# Altium schematic sheet SyncBoard1.SchDoc
size A2; SheetNumber: 1; SheetTotal: 1
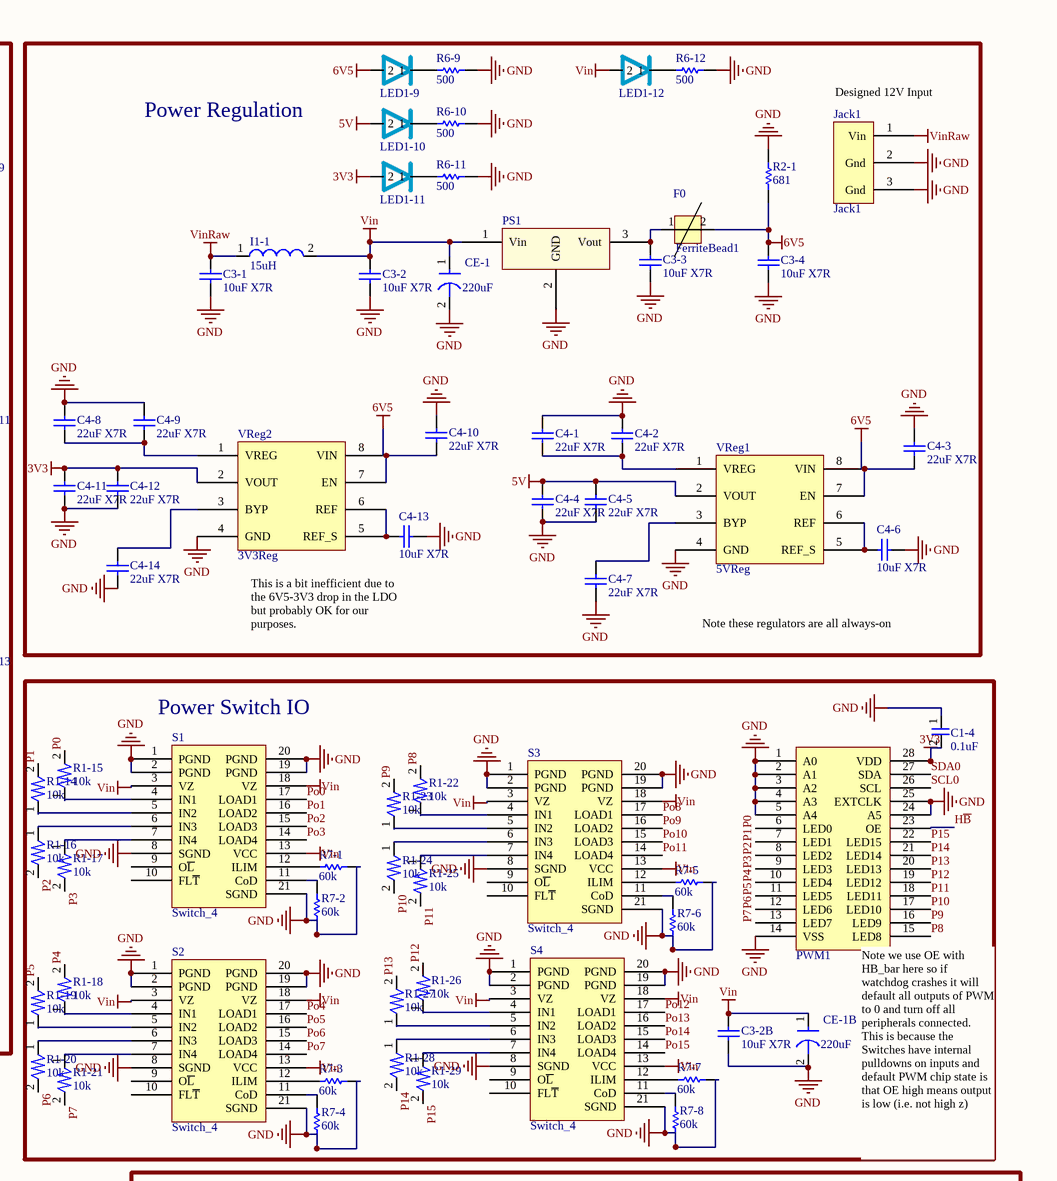
[diagram p0: SyncBoard1.SchDoc, top right]
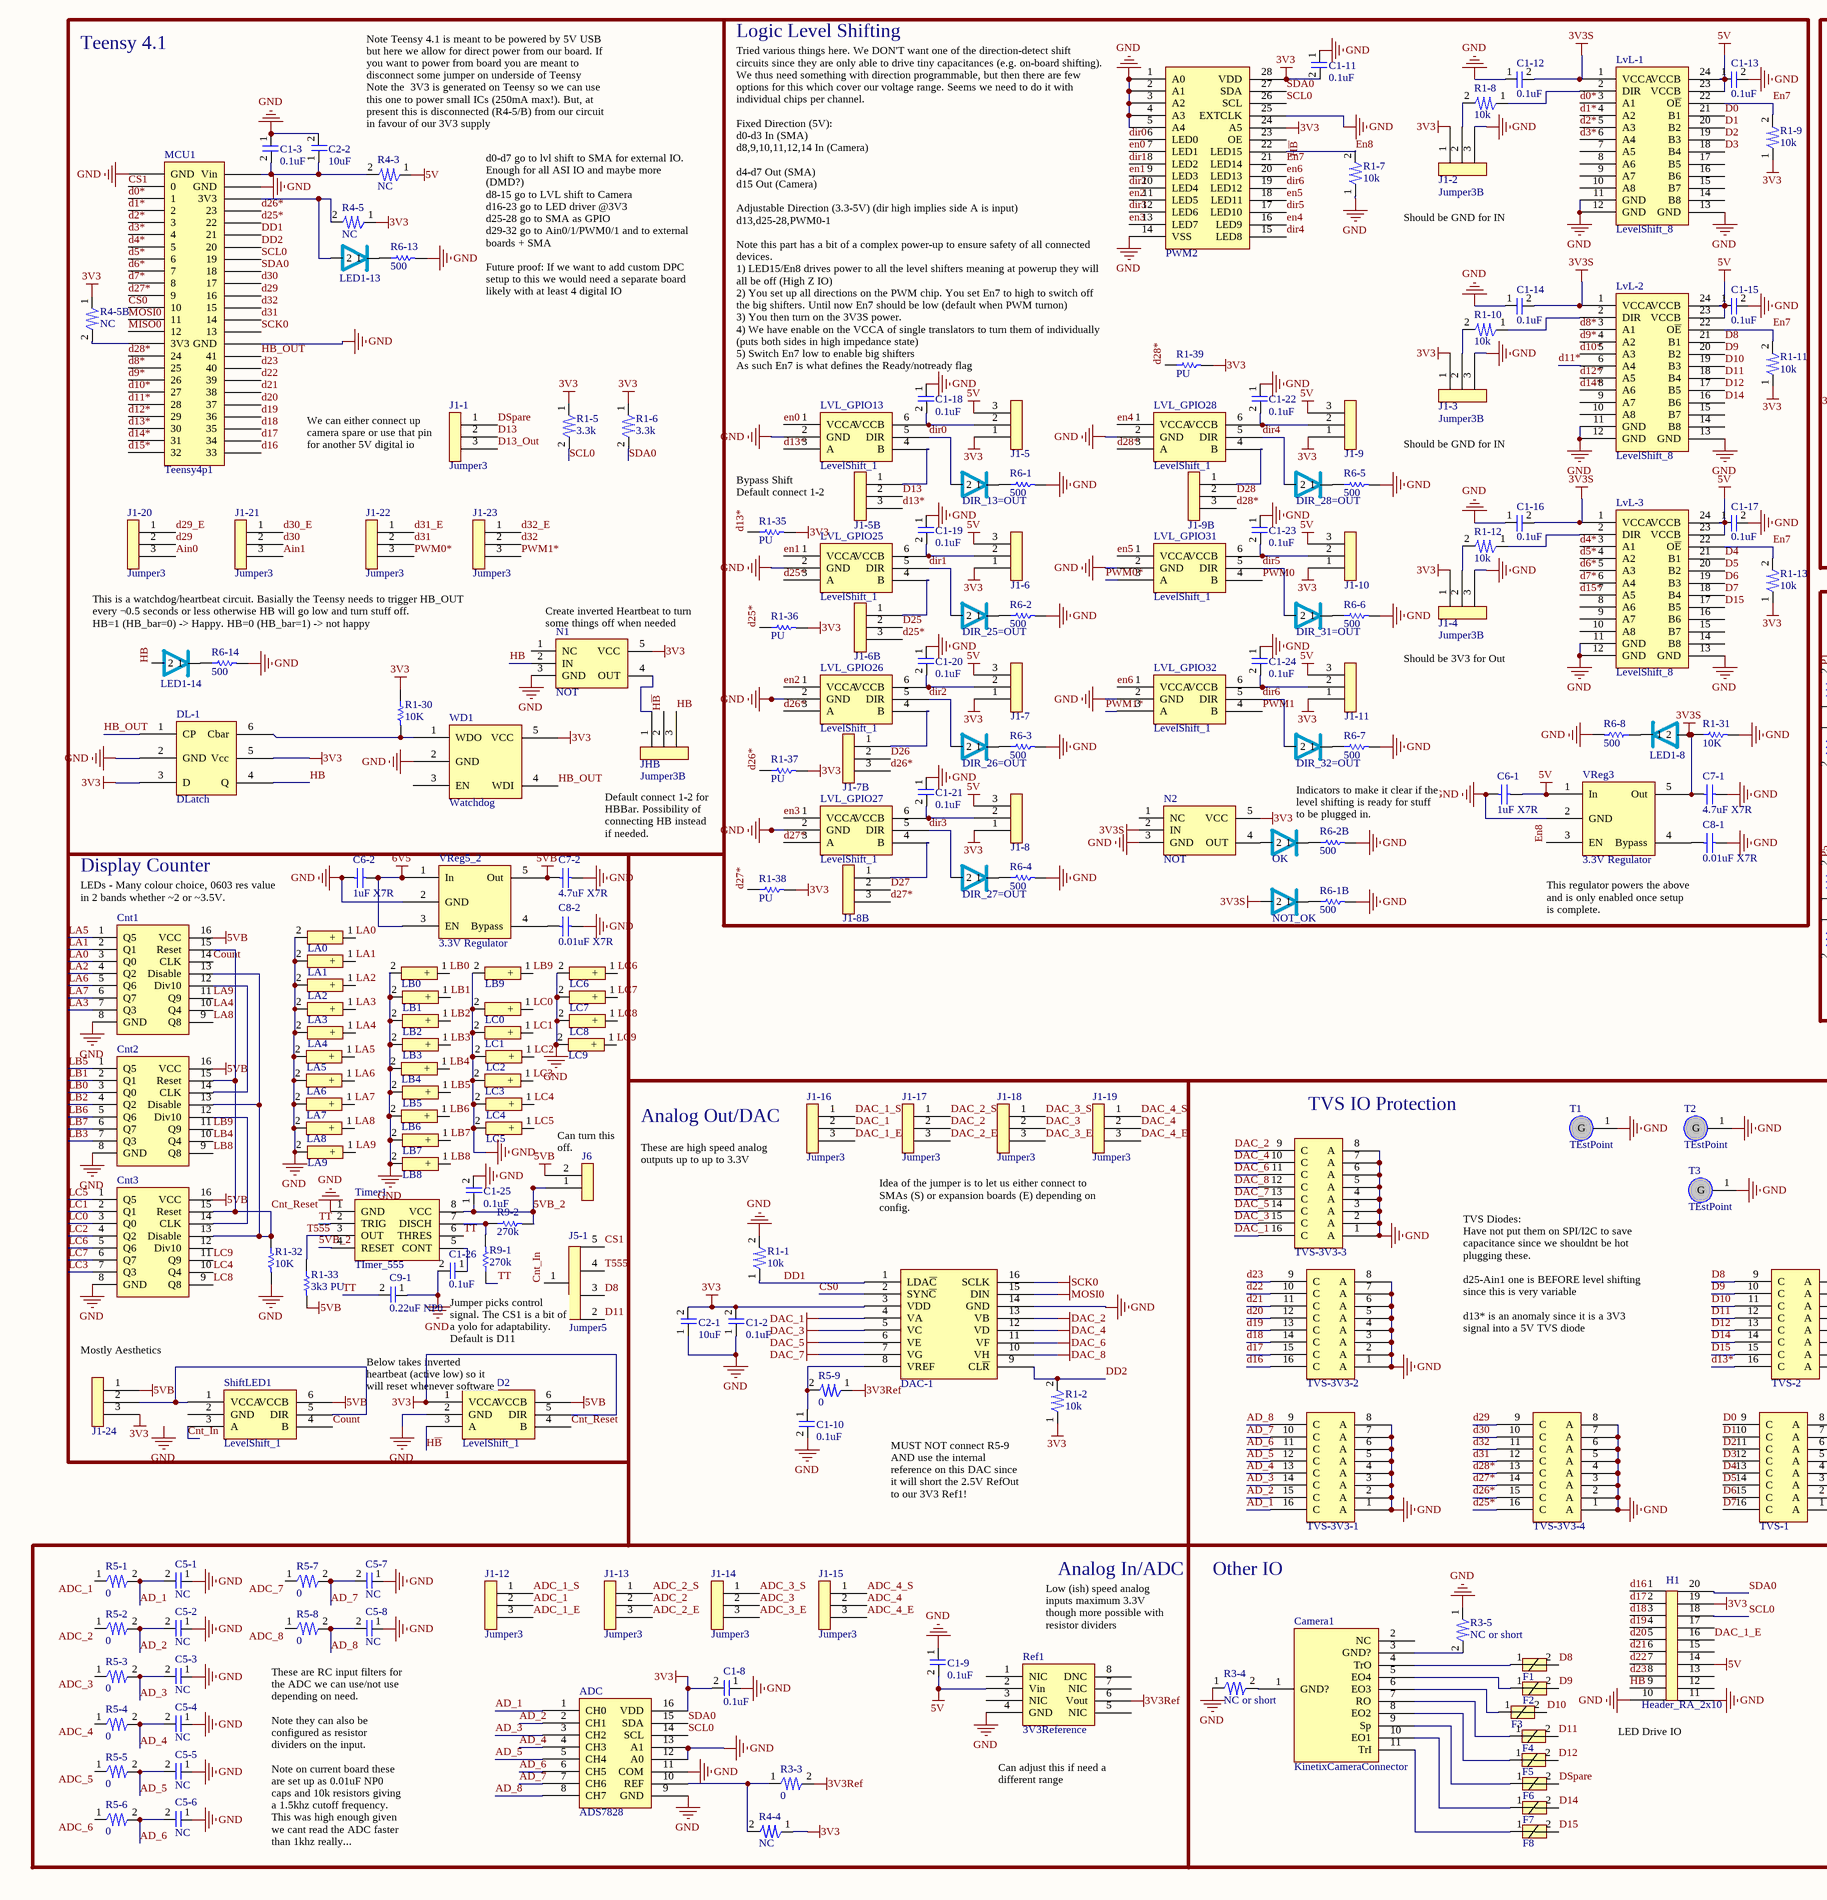
[diagram p1: SyncBoard1.SchDoc, bottom left]
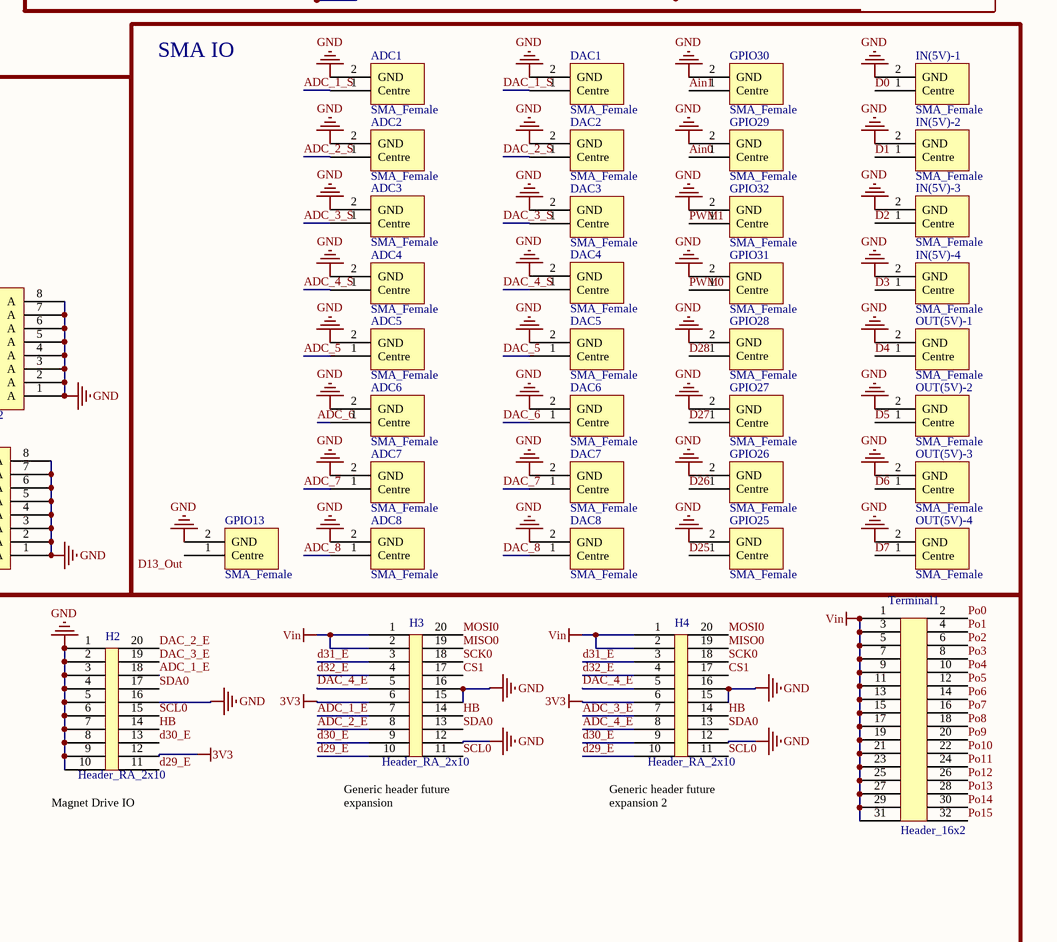
[diagram p2: SyncBoard1.SchDoc, bottom right]

## Parts
ADC  ADS7828  [16-TSSOP]
ADC1  SMA_Female  [SMA_Ferrite]
ADC2  SMA_Female  [SMA_Ferrite]
ADC3  SMA_Female  [SMA_Ferrite]
ADC4  SMA_Female  [SMA_Ferrite]
ADC5  SMA_Female  [SMA_Ferrite]
ADC6  SMA_Female  [SMA_Ferrite]
ADC7  SMA_Female  [SMA_Ferrite]
ADC8  SMA_Female  [SMA_Ferrite]
C1-2  0.1uF  [0805]
C1-3  0.1uF  [0805]
C1-4  0.1uF  [0805]
C1-8  0.1uF  [0805]
C1-9  0.1uF  [0805]
C1-10  0.1uF  [0805]
C1-11  0.1uF  [0805]
C1-12  0.1uF  [0805]
C1-13  0.1uF  [0805]
C1-14  0.1uF  [0805]
C1-15  0.1uF  [0805]
C1-16  0.1uF  [0805]
C1-17  0.1uF  [0805]
C1-18  0.1uF  [0805]
C1-19  0.1uF  [0805]
C1-20  0.1uF  [0805]
C1-21  0.1uF  [0805]
C1-22  0.1uF  [0805]
C1-23  0.1uF  [0805]
C1-24  0.1uF  [0805]
C1-25  0.1uF  [0805]
C1-26  0.1uF  [0805]
C2-1  10uF  [1206]
C2-2  10uF  [1206]
C3-1  10uF X7R  [1206]
C3-2  10uF X7R  [1206]
C3-2B  10uF X7R  [1206]
C3-3  10uF X7R  [1206]
C3-4  10uF X7R  [1206]
C4-1  22uF X7R  [1206]
C4-2  22uF X7R  [1206]
C4-3  22uF X7R  [1206]
C4-4  22uF X7R  [1206]
C4-5  22uF X7R  [1206]
C4-6  10uF X7R  [1206]
C4-7  22uF X7R  [1206]
C4-8  22uF X7R  [1206]
C4-9  22uF X7R  [1206]
C4-10  22uF X7R  [1206]
C4-11  22uF X7R  [1206]
C4-12  22uF X7R  [1206]
C4-13  10uF X7R  [1206]
C4-14  22uF X7R  [1206]
C5-1  NC  [0805]
C5-2  NC  [0805]
C5-3  NC  [0805]
C5-4  NC  [0805]
C5-5  NC  [0805]
C5-6  NC  [0805]
C5-7  NC  [0805]
C5-8  NC  [0805]
C6-1  1uF X7R  [0805]
C6-2  1uF X7R  [0805]
C7-1  4.7uF X7R  [0805]
C7-2  4.7uF X7R  [0805]
C8-1  0.01uF X7R  [0603]
C8-2  0.01uF X7R  [0603]
C9-1  0.22uF NP0  [1206]
Camera1  KinetixCameraConnector  [Connector_HR212]
CE-1  220uF  [ElectrolyticCapacitor]
CE-1B  220uF  [ElectrolyticCapacitor]
Cnt1  Counter_$017  [16-TSSOP]  (value not drawn)
Cnt2  Counter_$017  [16-TSSOP]  (value not drawn)
Cnt3  Counter_$017  [16-TSSOP]  (value not drawn)
DAC1  SMA_Female  [SMA_Ferrite]
DAC2  SMA_Female  [SMA_Ferrite]
DAC3  SMA_Female  [SMA_Ferrite]
DAC4  SMA_Female  [SMA_Ferrite]
DAC5  SMA_Female  [SMA_Ferrite]
DAC6  SMA_Female  [SMA_Ferrite]
DAC7  SMA_Female  [SMA_Ferrite]
DAC8  SMA_Female  [SMA_Ferrite]
DAC-1  AD5668-2  [16-TSSOP]  (value not drawn)
DIR_13=OUT  LEDindicator  [LEDindicator]  (value not drawn)
DIR_25=OUT  LEDindicator  [LEDindicator]  (value not drawn)
DIR_26=OUT  LEDindicator  [LEDindicator]  (value not drawn)
DIR_27=OUT  LEDindicator  [LEDindicator]  (value not drawn)
DIR_28=OUT  LEDindicator  [LEDindicator]  (value not drawn)
DIR_31=OUT  LEDindicator  [LEDindicator]  (value not drawn)
DIR_32=OUT  LEDindicator  [LEDindicator]  (value not drawn)
DL-1  DLatch  [6-TSSOP / SC-70-6]
F0  FerriteBead1  [FerriteBead1]
F1  FerriteBead2  [0603]  (value not drawn)
F2  FerriteBead2  [0603]  (value not drawn)
F3  FerriteBead2  [0603]  (value not drawn)
F4  FerriteBead2  [0603]  (value not drawn)
F5  FerriteBead2  [0603]  (value not drawn)
F6  FerriteBead2  [0603]  (value not drawn)
F7  FerriteBead2  [0603]  (value not drawn)
F8  FerriteBead2  [0603]  (value not drawn)
GPIO13  SMA_Female  [SMA_Ferrite]
GPIO25  SMA_Female  [SMA_Ferrite]
GPIO26  SMA_Female  [SMA_Ferrite]
GPIO27  SMA_Female  [SMA_Ferrite]
GPIO28  SMA_Female  [SMA_Ferrite]
GPIO29  SMA_Female  [SMA_Ferrite]
GPIO30  SMA_Female  [SMA_Ferrite]
GPIO31  SMA_Female  [SMA_Ferrite]
GPIO32  SMA_Female  [SMA_Ferrite]
H1  Header_RA_2x10  [HeaderRA 2x10]
H2  Header_RA_2x10  [HeaderRA 2x10]
H3  Header_RA_2x10  [HeaderRA 2x10]
H4  Header_RA_2x10  [HeaderRA 2x10]
I1-1  15uH  [Inductor1]
IN(5V)-1  SMA_Female  [SMA_Ferrite]
IN(5V)-2  SMA_Female  [SMA_Ferrite]
IN(5V)-3  SMA_Female  [SMA_Ferrite]
IN(5V)-4  SMA_Female  [SMA_Ferrite]
J1-1  Jumper3  [Jumper3B]
J1-2  Jumper3B  [Jumper3B]
J1-3  Jumper3B  [Jumper3B]
J1-4  Jumper3B  [Jumper3B]
J1-5  Jumper3B  [Jumper3B]  (value not drawn)
J1-5B  Jumper3B  [Jumper3B]  (value not drawn)
J1-6  Jumper3B  [Jumper3B]  (value not drawn)
J1-6B  Jumper3B  [Jumper3B]  (value not drawn)
J1-7  Jumper3B  [Jumper3B]  (value not drawn)
J1-7B  Jumper3B  [Jumper3B]  (value not drawn)
J1-8  Jumper3B  [Jumper3B]  (value not drawn)
J1-8B  Jumper3B  [Jumper3B]  (value not drawn)
J1-9  Jumper3B  [Jumper3B]  (value not drawn)
J1-9B  Jumper3B  [Jumper3B]  (value not drawn)
J1-10  Jumper3B  [Jumper3B]  (value not drawn)
J1-11  Jumper3B  [Jumper3B]  (value not drawn)
J1-12  Jumper3  [Jumper]
J1-13  Jumper3  [Jumper]
J1-14  Jumper3  [Jumper]
J1-15  Jumper3  [Jumper]
J1-16  Jumper3  [Jumper]
J1-17  Jumper3  [Jumper]
J1-18  Jumper3  [Jumper]
J1-19  Jumper3  [Jumper]
J1-20  Jumper3  [Jumper]
J1-21  Jumper3  [Jumper]
J1-22  Jumper3  [Jumper]
J1-23  Jumper3  [Jumper]
J1-24  Jumper3B  [Jumper3B]  (value not drawn)
J5-1  Jumper5  [Jumper5]
J6  Jumper2_Pins  [Jumper2_Pins]  (value not drawn)
Jack1  Jack1  [PowerJack]
JHB  Jumper3B  [Jumper3B]
LA0  LEDSINGLESIDE  [LedSingleSide]  (value not drawn)
LA1  LEDSINGLESIDE  [LedSingleSide]  (value not drawn)
LA2  LEDSINGLESIDE  [LedSingleSide]  (value not drawn)
LA3  LEDSINGLESIDE  [LedSingleSide]  (value not drawn)
LA4  LEDSINGLESIDE  [LedSingleSide]  (value not drawn)
LA5  LEDSINGLESIDE  [LedSingleSide]  (value not drawn)
LA6  LEDSINGLESIDE  [LedSingleSide]  (value not drawn)
LA7  LEDSINGLESIDE  [LedSingleSide]  (value not drawn)
LA8  LEDSINGLESIDE  [LedSingleSide]  (value not drawn)
LA9  LEDSINGLESIDE  [LedSingleSide]  (value not drawn)
LB0  LEDSINGLESIDE  [LedSingleSide]  (value not drawn)
LB1  LEDSINGLESIDE  [LedSingleSide]  (value not drawn)
LB2  LEDSINGLESIDE  [LedSingleSide]  (value not drawn)
LB3  LEDSINGLESIDE  [LedSingleSide]  (value not drawn)
LB4  LEDSINGLESIDE  [LedSingleSide]  (value not drawn)
LB5  LEDSINGLESIDE  [LedSingleSide]  (value not drawn)
LB6  LEDSINGLESIDE  [LedSingleSide]  (value not drawn)
LB7  LEDSINGLESIDE  [LedSingleSide]  (value not drawn)
LB8  LEDSINGLESIDE  [LedSingleSide]  (value not drawn)
LB9  LEDSINGLESIDE  [LedSingleSide]  (value not drawn)
LC0  LEDSINGLESIDE  [LedSingleSide]  (value not drawn)
LC1  LEDSINGLESIDE  [LedSingleSide]  (value not drawn)
LC2  LEDSINGLESIDE  [LedSingleSide]  (value not drawn)
LC3  LEDSINGLESIDE  [LedSingleSide]  (value not drawn)
LC4  LEDSINGLESIDE  [LedSingleSide]  (value not drawn)
LC5  LEDSINGLESIDE  [LedSingleSide]  (value not drawn)
LC6  LEDSINGLESIDE  [LedSingleSide]  (value not drawn)
LC7  LEDSINGLESIDE  [LedSingleSide]  (value not drawn)
LC8  LEDSINGLESIDE  [LedSingleSide]  (value not drawn)
LC9  LEDSINGLESIDE  [LedSingleSide]  (value not drawn)
LED1-8  LEDindicator  [LEDindicator]  (value not drawn)
LED1-9  LEDindicator  [LEDindicator]  (value not drawn)
LED1-10  LEDindicator  [LEDindicator]  (value not drawn)
LED1-11  LEDindicator  [LEDIndicator]  (value not drawn)
LED1-12  LEDindicator  [LEDindicator]  (value not drawn)
LED1-13  LEDindicator  [LEDindicator]  (value not drawn)
LED1-14  LEDindicator  [LEDindicator]  (value not drawn)
LvL-1  LevelShift_8  [24-TSSOP]
LvL-2  LevelShift_8  [24-TSSOP]
LvL-3  LevelShift_8  [24-TSSOP]
LVL_GPIO13  LevelShift_1  [6-TSSOP / SC-70-6]
LVL_GPIO25  LevelShift_1  [6-TSSOP / SC-70-6]
LVL_GPIO26  LevelShift_1  [6-TSSOP / SC-70-6]
LVL_GPIO27  LevelShift_1  [6-TSSOP / SC-70-6]
LVL_GPIO28  LevelShift_1  [6-TSSOP / SC-70-6]
LVL_GPIO31  LevelShift_1  [6-TSSOP / SC-70-6]
LVL_GPIO32  LevelShift_1  [6-TSSOP / SC-70-6]
MCU1  Teensy4p1  [Teensy4p1]
N1  NOT  [SOT23-5]
N2  NOT  [SOT23-5]
NOT_OK  LEDindicator  [LEDindicator]  (value not drawn)
OK  LEDindicator  [LEDindicator]  (value not drawn)
OUT(5V)-1  SMA_Female  [SMA_Ferrite]
OUT(5V)-2  SMA_Female  [SMA_Ferrite]
OUT(5V)-3  SMA_Female  [SMA_Ferrite]
OUT(5V)-4  SMA_Female  [SMA_Ferrite]
PS1  PS1  [PowerSupplySwitch]  (value not drawn)
PWM1  PWM28  [28-TSSOP]  (value not drawn)
PWM2  PWM28  [28-TSSOP]  (value not drawn)
R1-1  10k  [0805]
R1-2  10k  [0805]
R1-5  3.3k  [0805]
R1-6  3.3k  [0805]
R1-7  10k  [0805]
R1-8  10k  [0805]
R1-9  10k  [0805]
R1-10  10k  [0805]
R1-11  10k  [0805]
R1-12  10k  [0805]
R1-13  10k  [0805]
R1-14  10k  [0805]
R1-15  10k  [0805]
R1-16  10k  [0805]
R1-17  10k  [0805]
R1-18  10k  [0805]
R1-19  10k  [0805]
R1-20  10k  [0805]
R1-21  10k  [0805]
R1-22  10k  [0805]
R1-23  10k  [0805]
R1-24  10k  [0805]
R1-25  10k  [0805]
R1-26  10k  [0805]
R1-27  10k  [0805]
R1-28  10k  [0805]
R1-29  10k  [0805]
R1-30  10K  [0805]
R1-31  10K  [0805]
R1-32  10K  [0805]
R1-33  3k3 PU  [0805]
R1-35  PU  [0603]
R1-36  PU  [0603]
R1-37  PU  [0603]
R1-38  PU  [0603]
R1-39  PU  [0603]
R2-1  681  [1206]
R3-3  0  [0805]
R3-4  NC or short  [0805]
R3-5  NC or short  [0805]
R4-3  NC  [0805]
R4-4  NC  [0805]
R4-5  NC  [0805]
R4-5B  NC  [0805]
R5-1  0  [0805]
R5-2  0  [0805]
R5-3  0  [0805]
R5-4  0  [0805]
R5-5  0  [0805]
R5-6  0  [0805]
R5-7  0  [0805]
R5-8  0  [0805]
R5-9  0  [0805]
R6-1  500  [0603]
R6-1B  500  [0603]
R6-2  500  [0603]
R6-2B  500  [0603]
R6-3  500  [0603]
R6-4  500  [0603]
R6-5  500  [0603]
R6-6  500  [0603]
R6-7  500  [0603]
R6-8  500  [0603]
R6-9  500  [0603]
R6-10  500  [0603]
R6-11  500  [0603]
R6-12  500  [0603]
R6-13  500  [0603]
R6-14  500  [0603]
R7-1  60k  [0603]
R7-2  60k  [0603]
R7-3  60k  [0603]
R7-4  60k  [0603]
R7-5  60k  [0603]
R7-6  60k  [0603]
R7-7  60k  [0603]
R7-8  60k  [0603]
R9-1  270k  [0603]
R9-2  270k  [0603]
Ref1  3V3Reference  [8-SOIC-NoHeatPad]
S1  Switch_4  [20-HTSSOP]
S2  Switch_4  [20-HTSSOP]
S3  Switch_4  [20-HTSSOP]
S4  Switch_4  [20-HTSSOP]
ShiftLED1  LevelShift_1  [6-TSSOP / SC-70-6]
ShiftLED2  LevelShift_1  [6-TSSOP / SC-70-6]
T1  TEstPoint  [TestPoint]
T2  TEstPoint  [TestPoint]
T3  TEstPoint  [TestPoint]
Terminal1  Header_16x2  [Header 2x16]
Timer1  TImer_555  [8-SOIC-NoHeatPad]
TVS-1  TVS Diode Array  [16-SOIC]  (value not drawn)
TVS-2  TVS Diode Array  [16-SOIC]  (value not drawn)
TVS-3V3-1  TVS Diode Array  [16-SOIC]  (value not drawn)
TVS-3V3-2  TVS Diode Array  [16-SOIC]  (value not drawn)
TVS-3V3-3  TVS Diode Array  [16-SOIC]  (value not drawn)
TVS-3V3-4  TVS Diode Array  [16-SOIC]  (value not drawn)
VReg1  5VReg  [8-SOIC]
VReg2  3V3Reg  [8-SOIC]
VReg3  3.3V Regulator  [SOT23-5]
VReg5_2  3.3V Regulator  [SOT23-5]
WD1  Watchdog  [SOT23-5]

## Blocks framed on the sheet
Teensy 4.1: C1-3 C2-2 DL-1 J1-1 J1-20-J1-23 JHB LED1-13 LED1-14 MCU1 N1 R1-5 R1-6 R1-30 R4-3 R4-5 R4-5B R6-13 R6-14 WD1
Logic Level Shifting: C1-11-C1-24 C6-1 C7-1 C8-1 DIR_13=OUT DIR_25=OUT DIR_26=OUT DIR_27=OUT DIR_28=OUT DIR_31=OUT DIR_32=OUT J1-2-J1-5 J1-5B J1-6 J1-6B J1-7 J1-7B J1-8 J1-8B J1-9 J1-9B J1-10 J1-11 LED1-8 LvL-1-LvL-3 LVL_GPIO13 LVL_GPIO25-LVL_GPIO28 LVL_GPIO31 LVL_GPIO32 N2 NOT_OK OK PWM2 R1-7-R1-13 R1-31 R1-35-R1-39 R6-1 R6-1B R6-2 R6-2B R6-3-R6-8 VReg3
Power Regulation: C3-1-C3-4 C4-1-C4-14 CE-1 F0 I1-1 Jack1 LED1-9-LED1-12 PS1 R2-1 R6-9-R6-12 VReg1 VReg2
Power Switch IO: C1-4 C3-2B CE-1B PWM1 R1-14-R1-29 R7-1-R7-8 S1-S4
Display Counter: C1-25 C1-26 C6-2 C7-2 C8-2 C9-1 Cnt1-Cnt3 J1-24 J5-1 J6 LA0-LA9 LB0-LB9 LC0-LC9 R1-32 R1-33 R9-1 R9-2 ShiftLED1 ShiftLED2 Timer1 VReg5_2
SMA IO: ADC1-ADC8 DAC1-DAC8 GPIO13 GPIO25-GPIO32 IN(5V)-1-IN(5V)-4 OUT(5V)-1-OUT(5V)-4
Analog Out/DAC: C1-2 C1-10 C2-1 DAC-1 J1-16-J1-19 R1-1 R1-2 R5-9
TVS IO Protection: T1-T3 TVS-1 TVS-2 TVS-3V3-1-TVS-3V3-4
Analog In/ADC: ADC C1-8 C1-9 C5-1-C5-8 J1-12-J1-15 R3-3 R4-4 R5-1-R5-8 Ref1
Other IO: Camera1 F1-F8 H1-H4 R3-4 R3-5 Terminal1

## Nets
3V3: ADC.16(VDD) C1-2.2 C1-4.2 C1-8.2 C1-11.2 C2-1.2 C4-11.2 C4-12.2 DAC-1.3(VDD) DL-1.3(D) DL-1.5(Vcc) H1.19 H2.12 H3.6 H4.6 J1-2.1 J1-3.1 J1-4.1 J1-5.1 J1-6.1 J1-7.1 J1-8.1 J1-9.1 J1-10.1 J1-11.1 J1-24.3 LED1-11.2 N1.5(VCC) N2.5(VCC) PWM1.28(VDD) PWM2.24(A5) PWM2.28(VDD) R1-2.1 R1-5.1 R1-6.1 R1-9.1 R1-11.1 R1-13.1 R1-30.1 R1-35.2 R1-36.2 R1-37.2 R1-38.2 R1-39.2 R4-4.1 R4-5.1 R4-5B.1 ShiftLED2.1(VCCA) ShiftLED2.5(DIR) VReg2.2(VOUT) WD1.5(VCC)
3V3Ref: R3-3.2 R5-9.1 Ref1.6(Vout)
3V3S: C1-12.2 C1-14.2 C1-16.2 C7-1.1 LED1-8.2 LvL-1.1(VCCA) LvL-2.1(VCCA) LvL-3.1(VCCA) N2.2(IN) NOT_OK.2 R1-31.1 VReg3.5(Out)
5V: C1-9.2 C1-13.1 C1-15.1 C1-17.1 C4-4.2 C4-5.2 C6-1.1 H1.14 J1-5.3 J1-6.3 J1-7.3 J1-8.3 J1-9.3 J1-10.3 J1-11.3 LED1-10.2 LvL-1.23(VCCB) LvL-1.24(VCCB) LvL-2.23(VCCB) LvL-2.24(VCCB) LvL-3.23(VCCB) LvL-3.24(VCCB) R4-3.1 Ref1.2(Vin) VReg1.2(VOUT) VReg3.1(In)
5VB: C7-2.1 Cnt1.16(VCC) Cnt2.16(VCC) Cnt3.16(VCC) J1-24.1 J6.2 R1-33.2 ShiftLED1.6(VCCB) ShiftLED2.6(VCCB) VReg5_2.5(Out)
6V5: C3-4.1 C4-3.1 C4-10.1 C6-2.1 F0.2 LED1-9.2 R2-1.2 VReg1.7(EN) VReg1.8(VIN) VReg2.7(EN) VReg2.8(VIN) VReg5_2.1(In) VReg5_2.3(EN)
DAC_1: DAC-1.4(VA) J1-16.2 TVS-3V3-3.16(C)
DAC_2: DAC-1.13(VB) J1-17.2 TVS-3V3-3.9(C)
DAC_3: DAC-1.5(VC) J1-18.2 TVS-3V3-3.15(C)
DAC_4: DAC-1.12(VD) J1-19.2 TVS-3V3-3.10(C)
DAC_5: DAC5.1(Centre) DAC-1.6(VE) TVS-3V3-3.14(C)
DAC_6: DAC6.1(Centre) DAC-1.11(VF) TVS-3V3-3.11(C)
DAC_7: DAC7.1(Centre) DAC-1.7(VG) TVS-3V3-3.13(C)
DAC_8: DAC8.1(Centre) DAC-1.10(VH) TVS-3V3-3.12(C)
GND: ADC.9(GND) ADC.11(COM) ADC.12(A0) ADC.13(A1) ADC1.2(GND) ADC2.2(GND) ADC3.2(GND) ADC4.2(GND) ADC5.2(GND) ADC6.2(GND) ADC7.2(GND) ADC8.2(GND) C1-2.1 C1-3.1 C1-4.1 C1-8.1 C1-9.1 C1-10.2 C1-11.1 C1-12.1 C1-13.2 C1-14.1 C1-15.2 C1-16.1 C1-17.2 C1-18.1 C1-19.1 C1-20.1 C1-21.1 C1-22.1 C1-23.1 C1-24.1 C1-25.2 C1-26.2 C2-1.1 C2-2.2 C3-1.2 C3-2.2 C3-2B.2 C3-3.2 C3-4.2 C4-1.2 C4-2.2 C4-3.2 C4-4.1 C4-5.1 C4-6.1 C4-7.1 C4-8.2 C4-9.2 C4-10.2 C4-11.1 C4-12.1 C4-13.1 C4-14.1 C5-1.1 C5-2.1 C5-3.1 C5-4.1 C5-5.1 C5-6.1 C5-7.1 C5-8.1 C6-1.2 C6-2.2 C7-1.2 C7-2.2 C8-1.1 C8-2.1 C9-1.1 CE-1.2 CE-1B.2 Cnt1.8(GND) Cnt2.8(GND) Cnt3.8(GND) DAC1.2(GND) DAC2.2(GND) DAC3.2(GND) DAC4.2(GND) DAC5.2(GND) DAC6.2(GND) DAC7.2(GND) DAC8.2(GND) DAC-1.14(GND) DL-1.2(GND) GPIO13.2(GND) GPIO25.2(GND) GPIO26.2(GND) GPIO27.2(GND) GPIO28.2(GND) GPIO29.2(GND) GPIO30.2(GND) GPIO31.2(GND) GPIO32.2(GND) H1.10 H1.11 H2.1 H2.2 H2.3 H2.4 H2.5 H2.6 H2.7 H2.8 H2.9 H2.10 H2.16 H3.12 H3.15 H3.16 H4.12 H4.15 H4.16 IN(5V)-1.2(GND) IN(5V)-2.2(GND) IN(5V)-3.2(GND) IN(5V)-4.2(GND) J1-2.3 J1-3.3 J1-4.3 Jack1.2(Gnd) Jack1.3(Gnd) LA0.2(V-) LA1.2(V-) LA2.2(V-) LA3.2(V-) LA4.2(V-) LA5.2(V-) LA6.2(V-) LA7.2(V-) LA8.2(V-) LA9.2(V-) LB0.2(V-) LB1.2(V-) LB2.2(V-) LB3.2(V-) LB4.2(V-) LB5.2(V-) LB6.2(V-) LB7.2(V-) LB8.2(V-) LB9.2(V-) LC0.2(V-) LC1.2(V-) LC2.2(V-) LC3.2(V-) LC4.2(V-) LC5.2(V-) LC6.2(V-) LC7.2(V-) LC8.2(V-) LC9.2(V-) LvL-1.11(GND) LvL-1.12(GND) LvL-1.13(GND) LvL-2.11(GND) LvL-2.12(GND) LvL-2.13(GND) LvL-3.11(GND) LvL-3.12(GND) LvL-3.13(GND) LVL_GPIO13.2(GND) LVL_GPIO25.2(GND) LVL_GPIO26.2(GND) LVL_GPIO27.2(GND) LVL_GPIO28.2(GND) LVL_GPIO31.2(GND) LVL_GPIO32.2(GND) MCU1.0(GND) MCU1.33(GND) MCU1.46(GND) N1.3(GND) N2.3(GND) OUT(5V)-1.2(GND) OUT(5V)-2.2(GND) OUT(5V)-3.2(GND) OUT(5V)-4.2(GND) PS1.2(GND) PWM1.1(A0) PWM1.2(A1) PWM1.3(A2) PWM1.4(A3) PWM1.5(A4) PWM1.14(VSS) PWM1.24(A5) PWM1.25(EXTCLK) PWM2.1(A0) PWM2.2(A1) PWM2.3(A2) PWM2.4(A3) PWM2.5(A4) PWM2.14(VSS) PWM2.25(EXTCLK) R1-1.2 R1-7.1 R1-31.2 R1-32.2 R2-1.1 R3-4.1 R3-5.1 R6-1.2 R6-1B.2 R6-2.2 R6-2B.2 R6-3.2 R6-4.2 R6-5.2 R6-6.2 R6-7.2 R6-8.2 R6-9.2 R6-10.2 R6-11.2 R6-12.2 R6-13.2 R6-14.2 R7-1.2 R7-2.2 R7-3.2 R7-4.2 R7-5.2 R7-6.2 R7-7.2 R7-8.2 Ref1.4(GND) S1.1(PGND) S1.2(PGND) S1.8(SGND) S1.19(PGND) S1.20(PGND) S1.21(SGND) S2.1(PGND) S2.2(PGND) S2.8(SGND) S2.19(PGND) S2.20(PGND) S2.21(SGND) S3.1(PGND) S3.2(PGND) S3.8(SGND) S3.19(PGND) S3.20(PGND) S3.21(SGND) S4.1(PGND) S4.2(PGND) S4.8(SGND) S4.19(PGND) S4.20(PGND) S4.21(SGND) ShiftLED2.2(GND) T1.1(G) T2.1(G) T3.1(G) Timer1.1(GND) TVS-1.1(A) TVS-1.2(A) TVS-1.3(A) TVS-1.4(A) TVS-1.5(A) TVS-1.6(A) TVS-1.7(A) TVS-1.8(A) TVS-2.1(A) TVS-2.2(A) TVS-2.3(A) TVS-2.4(A) TVS-2.5(A) TVS-2.6(A) TVS-2.7(A) TVS-2.8(A) TVS-3V3-1.1(A) TVS-3V3-1.2(A) TVS-3V3-1.3(A) TVS-3V3-1.4(A) TVS-3V3-1.5(A) TVS-3V3-1.6(A) TVS-3V3-1.7(A) TVS-3V3-1.8(A) TVS-3V3-2.1(A) TVS-3V3-2.2(A) TVS-3V3-2.3(A) TVS-3V3-2.4(A) TVS-3V3-2.5(A) TVS-3V3-2.6(A) TVS-3V3-2.7(A) TVS-3V3-2.8(A) TVS-3V3-3.1(A) TVS-3V3-3.2(A) TVS-3V3-3.3(A) TVS-3V3-3.4(A) TVS-3V3-3.5(A) TVS-3V3-3.6(A) TVS-3V3-3.7(A) TVS-3V3-3.8(A) TVS-3V3-4.1(A) TVS-3V3-4.2(A) TVS-3V3-4.3(A) TVS-3V3-4.4(A) TVS-3V3-4.5(A) TVS-3V3-4.6(A) TVS-3V3-4.7(A) TVS-3V3-4.8(A) VReg1.4(GND) VReg2.4(GND) VReg3.2(GND) VReg5_2.2(GND) WD1.2(GND)
MOSI0: DAC-1.15(DIN) H3.20 H4.20 MCU1.12(11)
SCK0: DAC-1.16(SCLK) H3.18 H4.18 MCU1.34(13)
Vin: C3-2.1 C3-2B.1 CE-1.1 CE-1B.1 H3.1 H3.2 H4.1 H4.2 I1-1.2 LED1-12.2 PS1.1(Vin) S1.3(VZ) S1.13(VCC) S1.18(VZ) S2.3(VZ) S2.13(VCC) S2.18(VZ) S3.3(VZ) S3.13(VCC) S3.18(VZ) S4.3(VZ) S4.13(VCC) S4.18(VZ) Terminal1.1 Terminal1.3 Terminal1.5 Terminal1.7 Terminal1.9 Terminal1.11 Terminal1.13 Terminal1.15 Terminal1.17 Terminal1.19 Terminal1.21 Terminal1.23 Terminal1.25 Terminal1.27 Terminal1.29 Terminal1.31
VinRaw: C3-1.1 I1-1.1 Jack1.1(Vin)
5VB_2: C1-25.1 J6.1 R9-2.2 Timer1.4(RESET) Timer1.8(VCC)
AD_1: ADC.1(CH0) C5-1.2 R5-1.2 TVS-3V3-1.16(C)
AD_2: ADC.2(CH1) C5-2.2 R5-2.2 TVS-3V3-1.15(C)
AD_3: ADC.3(CH2) C5-3.2 R5-3.2 TVS-3V3-1.14(C)
AD_4: ADC.4(CH3) C5-4.2 R5-4.2 TVS-3V3-1.13(C)
AD_5: ADC.5(CH4) C5-5.2 R5-5.2 TVS-3V3-1.12(C)
AD_6: ADC.6(CH5) C5-6.2 R5-6.2 TVS-3V3-1.11(C)
AD_7: ADC.7(CH6) C5-7.2 R5-7.2 TVS-3V3-1.10(C)
AD_8: ADC.8(CH7) C5-8.2 R5-8.2 TVS-3V3-1.9(C)
ADC_1: J1-12.2 R5-1.1
ADC_1_E: H2.18 H3.7 J1-12.3
ADC_1_S: ADC1.1(Centre) J1-12.1
ADC_2: J1-13.2 R5-2.1
ADC_2_E: H3.8 J1-13.3
ADC_2_S: ADC2.1(Centre) J1-13.1
ADC_3: J1-14.2 R5-3.1
ADC_3_E: H4.7 J1-14.3
ADC_3_S: ADC3.1(Centre) J1-14.1
ADC_4: J1-15.2 R5-4.1
ADC_4_E: H4.8 J1-15.3
ADC_4_S: ADC4.1(Centre) J1-15.1
ADC_5: ADC5.1(Centre) R5-5.1
ADC_6: ADC6.1(Centre) R5-6.1
ADC_7: ADC7.1(Centre) R5-7.1
ADC_8: ADC8.1(Centre) R5-8.1
Ain0: GPIO29.1(Centre) J1-20.3
Ain1: GPIO30.1(Centre) J1-21.3
Cnt_In: J5-1.1 ShiftLED1.3(A)
Cnt_Reset: Cnt1.13(Disable) Cnt1.15(Reset) Cnt2.13(Disable) Cnt2.15(Reset) Cnt3.13(Disable) Cnt3.15(Reset) R1-32.1 ShiftLED2.4(B)
Count: Cnt1.14(CLK) ShiftLED1.4(B)
CS0: DAC-1.2(SYN~{C}) MCU1.11(10)
CS1: H3.17 H4.17 J5-1.5 MCU1.1(0)
D0: IN(5V)-1.1(Centre) LvL-1.21(B1) TVS-1.9(C)
d0*: LvL-1.3(A1) MCU1.2(1)
D1: IN(5V)-2.1(Centre) LvL-1.20(B2) TVS-1.10(C)
d1*: LvL-1.4(A2) MCU1.3(2)
D2: IN(5V)-3.1(Centre) LvL-1.19(B3) TVS-1.11(C)
d2*: LvL-1.5(A3) MCU1.4(3)
D3: IN(5V)-4.1(Centre) LvL-1.18(B4) TVS-1.12(C)
d3*: LvL-1.6(A4) MCU1.5(4)
D4: LvL-3.21(B1) OUT(5V)-1.1(Centre) TVS-1.13(C)
d4*: LvL-3.3(A1) MCU1.6(5)
D5: LvL-3.20(B2) OUT(5V)-2.1(Centre) TVS-1.14(C)
d5*: LvL-3.4(A2) MCU1.7(6)
D6: LvL-3.19(B3) OUT(5V)-3.1(Centre) TVS-1.15(C)
d6*: LvL-3.5(A3) MCU1.8(7)
D7: LvL-3.18(B4) OUT(5V)-4.1(Centre) TVS-1.16(C)
d7*: LvL-3.6(A4) MCU1.9(8)
D8: F1.2 J5-1.3 LvL-2.21(B1) TVS-2.9(C)
d8*: LvL-2.3(A1) MCU1.16(25)
D9: F2.2 LvL-2.20(B2) TVS-2.10(C)
d9*: LvL-2.4(A2) MCU1.17(26)
D10: F3.2 LvL-2.19(B3) TVS-2.11(C)
d10*: LvL-2.5(A3) MCU1.18(27)
D11: F4.2 J5-1.2 LvL-2.18(B4) TVS-2.12(C)
d11*: LvL-2.6(A4) MCU1.19(28)
D12: F5.2 LvL-2.17(B5) TVS-2.13(C)
d12*: LvL-2.7(A5) MCU1.20(29)
D13: J1-1.2 J1-5B.2
d13*: J1-5B.3 LVL_GPIO13.3(A) MCU1.21(30) R1-35.1 TVS-2.16(C)
D13_Out: GPIO13.1(Centre) J1-1.3
D14: F7.2 LvL-2.16(B6) TVS-2.14(C)
d14*: LvL-2.8(A6) MCU1.22(31)
D15: F8.2 LvL-3.17(B5) TVS-2.15(C)
d15*: LvL-3.7(A5) MCU1.23(32)
d16: H1.1 MCU1.24(33) TVS-3V3-2.16(C)
d17: H1.2 MCU1.25(34) TVS-3V3-2.15(C)
d18: H1.3 MCU1.26(35) TVS-3V3-2.14(C)
d19: H1.4 MCU1.27(36) TVS-3V3-2.13(C)
d20: H1.5 MCU1.28(37) TVS-3V3-2.12(C)
d21: H1.6 MCU1.29(38) TVS-3V3-2.11(C)
d22: H1.7 MCU1.30(39) TVS-3V3-2.10(C)
d23: H1.8 MCU1.31(40) TVS-3V3-2.9(C)
D25: GPIO25.1(Centre) J1-6B.2
d25*: J1-6B.3 LVL_GPIO25.3(A) MCU1.43(22) R1-36.1 TVS-3V3-4.16(C)
D26: GPIO26.1(Centre) J1-7B.2
d26*: J1-7B.3 LVL_GPIO26.3(A) MCU1.44(23) R1-37.1 TVS-3V3-4.15(C)
D27: GPIO27.1(Centre) J1-8B.2
d27*: J1-8B.3 LVL_GPIO27.3(A) MCU1.10(9) R1-38.1 TVS-3V3-4.14(C)
D28: GPIO28.1(Centre) J1-9B.2
d28*: J1-9B.3 LVL_GPIO28.3(A) MCU1.15(24) R1-39.1 TVS-3V3-4.13(C)
d29: J1-20.2 MCU1.37(16) TVS-3V3-4.9(C)
d29_E: H2.11 H3.10 H4.10 J1-20.1
d30: J1-21.2 MCU1.38(17) TVS-3V3-4.10(C)
d30_E: H2.13 H3.9 H4.9 J1-21.1
d31: J1-22.2 MCU1.35(14) TVS-3V3-4.12(C)
d31_E: H3.3 H4.3 J1-22.1
d32: J1-23.2 MCU1.36(15) TVS-3V3-4.11(C)
d32_E: H3.4 H4.4 J1-23.1
DAC_1_E: H1.16 J1-16.3
DAC_1_S: DAC1.1(Centre) J1-16.1
DAC_2_E: H2.20 J1-17.3
DAC_2_S: DAC2.1(Centre) J1-17.1
DAC_3_E: H2.19 J1-18.3
DAC_3_S: DAC3.1(Centre) J1-18.1
DAC_4_E: H3.5 H4.5 J1-19.3
DAC_4_S: DAC4.1(Centre) J1-19.1
DD1: DAC-1.1(LDA~{C}) MCU1.42(21) R1-1.1
DD2: DAC-1.9(CL~{R}) MCU1.41(20) R1-2.2
dir0: DIR_13=OUT.2 LVL_GPIO13.5(DIR) PWM2.6(LED0)
dir1: DIR_25=OUT.2 LVL_GPIO25.5(DIR) PWM2.8(LED2)
dir2: DIR_26=OUT.2 LVL_GPIO26.5(DIR) PWM2.10(LED4)
dir3: DIR_27=OUT.2 LVL_GPIO27.5(DIR) PWM2.12(LED6)
dir4: DIR_28=OUT.2 LVL_GPIO28.5(DIR) PWM2.15(LED8)
dir5: DIR_31=OUT.2 LVL_GPIO31.5(DIR) PWM2.17(LED10)
dir6: DIR_32=OUT.2 LVL_GPIO32.5(DIR) PWM2.19(LED12)
DSpare: F6.2 J1-1.1
en0: LVL_GPIO13.1(VCCA) PWM2.7(LED1)
en1: LVL_GPIO25.1(VCCA) PWM2.9(LED3)
en2: LVL_GPIO26.1(VCCA) PWM2.11(LED5)
en3: LVL_GPIO27.1(VCCA) PWM2.13(LED7)
en4: LVL_GPIO28.1(VCCA) PWM2.16(LED9)
en5: LVL_GPIO31.1(VCCA) PWM2.18(LED11)
en6: LVL_GPIO32.1(VCCA) PWM2.20(LED13)
En7: LvL-1.22(O~{E}) LvL-2.22(O~{E}) LvL-3.22(O~{E}) PWM2.21(LED14) R1-9.2 R1-11.2 R1-13.2
En8: PWM2.22(LED15) R1-7.2 VReg3.3(EN)
HB: DL-1.4(Q) H1.9 H2.14 H3.14 H4.14 JHB.3 LED1-14.2 N1.2(IN)
H~{B}: JHB.2 PWM1.23(OE) PWM2.23(OE) ShiftLED2.3(A)
HB_OUT: DL-1.1(CP) MCU1.32(41) WD1.4(WDI)
LA0: Cnt1.3(Q0) LA0.1(+)
LA1: Cnt1.2(Q1) LA1.1(+)
LA2: Cnt1.4(Q2) LA2.1(+)
LA3: Cnt1.7(Q3) LA3.1(+)
LA4: Cnt1.10(Q4) LA4.1(+)
LA5: Cnt1.1(Q5) LA5.1(+)
LA6: Cnt1.5(Q6) LA6.1(+)
LA7: Cnt1.6(Q7) LA7.1(+)
LA8: Cnt1.9(Q8) LA8.1(+)
LA9: Cnt1.11(Q9) LA9.1(+)
LB0: Cnt2.3(Q0) LB0.1(+)
LB1: Cnt2.2(Q1) LB1.1(+)
LB2: Cnt2.4(Q2) LB2.1(+)
LB3: Cnt2.7(Q3) LB3.1(+)
LB4: Cnt2.10(Q4) LB4.1(+)
LB5: Cnt2.1(Q5) LB5.1(+)
LB6: Cnt2.5(Q6) LB6.1(+)
LB7: Cnt2.6(Q7) LB7.1(+)
LB8: Cnt2.9(Q8) LB8.1(+)
LB9: Cnt2.11(Q9) LB9.1(+)
LC0: Cnt3.3(Q0) LC0.1(+)
LC1: Cnt3.2(Q1) LC1.1(+)
LC2: Cnt3.4(Q2) LC2.1(+)
LC3: Cnt3.7(Q3) LC3.1(+)
LC4: Cnt3.10(Q4) LC4.1(+)
LC5: Cnt3.1(Q5) LC5.1(+)
LC6: Cnt3.5(Q6) LC6.1(+)
LC7: Cnt3.6(Q7) LC7.1(+)
LC8: Cnt3.9(Q8) LC8.1(+)
LC9: Cnt3.11(Q9) LC9.1(+)
MISO0: H3.19 H4.19 MCU1.13(12)
P0: PWM1.6(LED0) R1-15.2
P1: PWM1.7(LED1) R1-14.2
P2: PWM1.8(LED2) R1-16.2
P3: PWM1.9(LED3) R1-17.2
P4: PWM1.10(LED4) R1-18.2
P5: PWM1.11(LED5) R1-19.2
P6: PWM1.12(LED6) R1-20.2
P7: PWM1.13(LED7) R1-21.2
P8: PWM1.15(LED8) R1-22.2
P9: PWM1.16(LED9) R1-23.2
P10: PWM1.17(LED10) R1-24.2
P11: PWM1.18(LED11) R1-25.2
P12: PWM1.19(LED12) R1-26.2
P13: PWM1.20(LED13) R1-27.2
P14: PWM1.21(LED14) R1-28.2
P15: PWM1.22(LED15) R1-29.2
Po0: S1.17(LOAD1) Terminal1.2
Po1: S1.16(LOAD2) Terminal1.4
Po2: S1.15(LOAD3) Terminal1.6
Po3: S1.14(LOAD4) Terminal1.8
Po4: S2.17(LOAD1) Terminal1.10
Po5: S2.16(LOAD2) Terminal1.12
Po6: S2.15(LOAD3) Terminal1.14
Po7: S2.14(LOAD4) Terminal1.16
Po8: S3.17(LOAD1) Terminal1.18
Po9: S3.16(LOAD2) Terminal1.20
Po10: S3.15(LOAD3) Terminal1.22
Po11: S3.14(LOAD4) Terminal1.24
Po12: S4.17(LOAD1) Terminal1.26
Po13: S4.16(LOAD2) Terminal1.28
Po14: S4.15(LOAD3) Terminal1.30
Po15: S4.14(LOAD4) Terminal1.32
PWM0: GPIO31.1(Centre) LVL_GPIO31.4(B)
PWM0*: J1-22.3 LVL_GPIO31.3(A)
PWM1: GPIO32.1(Centre) LVL_GPIO32.4(B)
PWM1*: J1-23.3 LVL_GPIO32.3(A)
SCL0: ADC.14(SCL) H1.18 H2.15 H3.11 H4.11 MCU1.40(19) PWM1.26(SCL) PWM2.26(SCL) R1-5.2
SDA0: ADC.15(SDA) H1.20 H2.17 H3.13 H4.13 MCU1.39(18) PWM1.27(SDA) PWM2.27(SDA) R1-6.2
T555: J5-1.4 R1-33.1 Timer1.3(OUT)
TT: C9-1.2 R9-1.1 Timer1.2(TRIG) Timer1.6(THRES)
NetADC_10: ADC.10(REF) R3-3.1 R4-4.2
NetC1-3_2: C1-3.2 C2-2.1 MCU1.47(Vin) R4-3.2
NetC1-10_1: C1-10.1 DAC-1.8(VREF) R5-9.2
NetC1-18_2: C1-18.2 J1-5.2 LVL_GPIO13.6(VCCB)
NetC1-19_2: C1-19.2 J1-6.2 LVL_GPIO25.6(VCCB)
NetC1-20_2: C1-20.2 J1-7.2 LVL_GPIO26.6(VCCB)
NetC1-21_2: C1-21.2 J1-8.2 LVL_GPIO27.6(VCCB)
NetC1-22_2: C1-22.2 J1-9.2 LVL_GPIO28.6(VCCB)
NetC1-23_2: C1-23.2 J1-10.2 LVL_GPIO31.6(VCCB)
NetC1-24_2: C1-24.2 J1-11.2 LVL_GPIO32.6(VCCB)
NetC1-26_1: C1-26.1 Timer1.5(CONT)
NetC3-3_1: C3-3.1 F0.1 PS1.3(Vout)
NetC4-1_1: C4-1.1 C4-2.1 VReg1.1(VREG)
NetC4-6_2: C4-6.2 VReg1.5(REF_S) VReg1.6(REF)
NetC4-7_2: C4-7.2 VReg1.3(BYP)
NetC4-8_1: C4-8.1 C4-9.1 VReg2.1(VREG)
NetC4-13_2: C4-13.2 VReg2.5(REF_S) VReg2.6(REF)
NetC4-14_2: C4-14.2 VReg2.3(BYP)
NetC8-1_2: C8-1.2 VReg3.4(Bypass)
NetC8-2_2: C8-2.2 VReg5_2.4(Bypass)
NetCamera1_1: Camera1.1(GND?) R3-4.2
NetCamera1_3: Camera1.3(GND?) R3-5.2
NetCamera1_4: Camera1.4(TrO) F1.1
NetCamera1_5: Camera1.5(EO4) F2.1
NetCamera1_6: Camera1.6(EO3) F3.1
NetCamera1_7: Camera1.7(RO) F4.1
NetCamera1_8: Camera1.8(EO2) F5.1
NetCamera1_9: Camera1.9(Sp) F6.1
NetCamera1_10: Camera1.10(EO1) F7.1
NetCamera1_11: Camera1.11(TrI) F8.1
NetCnt1_12: Cnt1.12(Div10) Cnt2.14(CLK)
NetCnt2_12: Cnt2.12(Div10) Cnt3.14(CLK)
NetDIR_13=OUT_1: DIR_13=OUT.1 R6-1.1
NetDIR_25=OUT_1: DIR_25=OUT.1 R6-2.1
NetDIR_26=OUT_1: DIR_26=OUT.1 R6-3.1
NetDIR_27=OUT_1: DIR_27=OUT.1 R6-4.1
NetDIR_28=OUT_1: DIR_28=OUT.1 R6-5.1
NetDIR_31=OUT_1: DIR_31=OUT.1 R6-6.1
NetDIR_32=OUT_1: DIR_32=OUT.1 R6-7.1
NetDL-1_6: DL-1.6(Cbar) R1-30.2 WD1.1(WDO)
NetJ1-2_2: J1-2.2 R1-8.2
NetJ1-3_2: J1-3.2 R1-10.2
NetJ1-4_2: J1-4.2 R1-12.2
NetJ1-5B_1: J1-5B.1 LVL_GPIO13.4(B)
NetJ1-6B_1: J1-6B.1 LVL_GPIO25.4(B)
NetJ1-7B_1: J1-7B.1 LVL_GPIO26.4(B)
NetJ1-8B_1: J1-8B.1 LVL_GPIO27.4(B)
NetJ1-9B_1: J1-9B.1 LVL_GPIO28.4(B)
NetJ1-24_2: J1-24.2 ShiftLED1.1(VCCA) ShiftLED1.5(DIR)
NetJHB_1: JHB.1 N1.4(OUT)
NetLED1-8_1: LED1-8.1 R6-8.1
NetLED1-9_1: LED1-9.1 R6-9.1
NetLED1-10_1: LED1-10.1 R6-10.1
NetLED1-11_1: LED1-11.1 R6-11.1
NetLED1-12_1: LED1-12.1 R6-12.1
NetLED1-13_1: LED1-13.1 R6-13.1
NetLED1-13_2: LED1-13.2 MCU1.45(3V3) R4-5.2
NetLED1-14_1: LED1-14.1 R6-14.1
NetLvL-1_2: LvL-1.2(DIR) R1-8.1
NetLvL-2_2: LvL-2.2(DIR) R1-10.1
NetLvL-3_2: LvL-3.2(DIR) R1-12.1
NetMCU1_14: MCU1.14(3V3) R4-5B.2
NetN2_4: N2.4(OUT) OK.2
NetNOT_OK_1: NOT_OK.1 R6-1B.1
NetOK_1: OK.1 R6-2B.1
NetR1-14_1: R1-14.1 S1.5(IN2)
NetR1-15_1: R1-15.1 S1.4(IN1)
NetR1-16_1: R1-16.1 S1.6(IN3)
NetR1-17_1: R1-17.1 S1.7(IN4)
NetR1-18_1: R1-18.1 S2.4(IN1)
NetR1-19_1: R1-19.1 S2.5(IN2)
NetR1-20_1: R1-20.1 S2.6(IN3)
NetR1-21_1: R1-21.1 S2.7(IN4)
NetR1-22_1: R1-22.1 S3.4(IN1)
NetR1-23_1: R1-23.1 S3.5(IN2)
NetR1-24_1: R1-24.1 S3.6(IN3)
NetR1-25_1: R1-25.1 S3.7(IN4)
NetR1-26_1: R1-26.1 S4.4(IN1)
NetR1-27_1: R1-27.1 S4.5(IN2)
NetR1-28_1: R1-28.1 S4.6(IN3)
NetR1-29_1: R1-29.1 S4.7(IN4)
NetR7-1_1: R7-1.1 S1.12(ILIM)
NetR7-2_1: R7-2.1 S1.11(CoD)
NetR7-3_1: R7-3.1 S2.12(ILIM)
NetR7-4_1: R7-4.1 S2.11(CoD)
NetR7-5_1: R7-5.1 S3.12(ILIM)
NetR7-6_1: R7-6.1 S3.11(CoD)
NetR7-7_1: R7-7.1 S4.12(ILIM)
NetR7-8_1: R7-8.1 S4.11(CoD)
NetR9-1_2: R9-1.2 R9-2.1 Timer1.7(DISCH)

Not connected (* = marked no-connect by the designer): Camera1 2(NC); Cnt3 12(Div10); H1 12 13 15 17; LvL-1 7(A5) 8(A6) 9(A7) 10(A8) 14(B8) 15(B7) 16(B6) 17(B5); LvL-2 9(A7) 10(A8) 14(B8) 15(B7); LvL-3 8(A6) 9(A7) 10(A8) 14(B8) 15(B7) 16(B6); N1 1(NC); N2 1(NC); Ref1 1(NIC) 3(NIC) 5(NIC) 7(NIC) 8(DNC); S1 9(O~{L}) 10(FL~{T}); S2 9(O~{L}) 10(FL~{T}); S3 9(O~{L}) 10(FL~{T}); S4 9(O~{L}) 10(FL~{T}); ShiftLED1 2(GND); WD1 3(EN)

## Notes on the sheet
- (near Jack1) Designed 12V Input
- Note Teensy 4.1 is meant to be powered by 5V USB but here we allow for direct power from our board. If you want to power from board you are meant to disconnect some jumper on underside of Teensy
  Note the  3V3 is generated on Teensy so we can use this one to power small ICs (250mA max!). But, at present this is disconnected (R4-5/B) from our circuit in favour of our 3V3 supply
- Should be GND for IN
- d0-d7 go to lvl shift to SMA for external IO. Enough for all ASI IO and maybe more (DMD?)
  d8-15 go to LVL shift to Camera
  d16-23 go to LED driver @3V3
  d25-28 go to SMA as GPIO
  d29-32 go to Ain0/1/PWM0/1 and to external boards + SMA
  Future proof: If we want to add custom DPC setup to this we would need a separate board likely with at least 4 digital IO
- (near C1-18) Tried various things here. We DON'T want one of the direction-detect shift circuits since they are only able to drive tiny capacitances (e.g. on-board shifting). We thus need something with direction programmable, but then there are few options for this which cover our voltage range. Seems we need to do it with individual chips per channel.
  Fixed Direction (5V):
  d0-d3 In (SMA)
  d8,9,10,11,12,14 In (Camera)
  d4-d7 Out (SMA)
  d15 Out (Camera)
  Adjustable Direction (3.3-5V) (dir high implies side A is input)
  d13,d25-28,PWM0-1
  Note this part has a bit of a complex power-up to ensure safety of all connected devices.
  1) LED15/En8 drives power to all the level shifters meaning at powerup they will all be off (High Z IO)
  2) You set up all directions on the PWM chip. You set En7 to high to switch off the big shifters. Until now En7 should be low (default when PWM turnon)
  3) You then turn on the 3V3S power.
  4) We have enable on the VCCA of single translators to turn them of individually (puts both sides in high impedance state)
  5) Switch En7 low to enable big shifters
  As such En7 is what defines the Ready/notready flag
- (near J1-1) We can either connect up camera spare or use that pin for another 5V digital io
- Bypass Shift
  Default connect 1-2
- This is a bit inefficient due to the 6V5-3V3 drop in the LDO but probably OK for our purposes.
- Note these regulators are all always-on
- This is a watchdog/heartbeat circuit. Basially the Teensy needs to trigger HB_OUT every ¬0.5 seconds or less otherwise HB will go low and turn stuff off.
  HB=1 (HB_bar=0) -> Happy. HB=0 (HB_bar=1) -> not happy
- (near N1) Create inverted Heartbeat to turn some things off when needed
- Should be 3V3 for Out
- Indicators to make it clear if the level shifting is ready for stuff to be plugged in.
- Default connect 1-2 for HBBar. Possibility of connecting HB instead if needed.
- LEDs - Many colour choice, 0603 res value in 2 bands whether ~2 or ~3.5V.
- This regulator powers the above and is only enabled once setup is complete.
- (near PWM1) Note we use OE with HB_bar here so if watchdog crashes it will default all outputs of PWM to 0 and turn off all peripherals connected. This is because the Switches have internal pulldowns on inputs and default PWM chip state is that OE high means output is low (i.e. not high z)
- Can turn this off.
- These are high speed analog outputs up to up to 3.3V
- Idea of the jumper is to let us either connect to SMAs (S) or expansion boards (E) depending on config.
- Mostly Aesthetics
- (near J5-1) Jumper picks control signal. The CS1 is a bit of a yolo for adaptability. Default is D11
- TVS Diodes:
  Have not put them on SPI/I2C to save capacitance since we shouldnt be hot plugging these.
  d25-Ain1 one is BEFORE level shifting since this is very variable
  d13* is an anomaly since it is a 3V3 signal into a 5V TVS diode
- (near ShiftLED2) Below takes inverted heartbeat (active low) so it will reset whenever software resets
- MUST NOT connect R5-9 AND use the internal reference on this DAC since it will short the 2.5V RefOut to our 3V3 Ref1!
- (near Ref1) Low (ish) speed analog inputs maximum 3.3V though more possible with resistor dividers
- (near H3) Generic header future expansion
- (near H4) Generic header future expansion 2
- (near Ref1) Can adjust this if need a different range
- (near H1) LED Drive IO
- (near H2) Magnet Drive IO
- These are RC input filters for the ADC we can use/not use depending on need.
  Note they can also be configured as resistor dividers on the input.
  Note on current board these are set up as 0.01uF NP0 caps and 10k resistors giving a 1.5khz cutoff frequency. This was high enough given we cant read the ADC faster than 1khz really...
- Labels drawn without touching a wire or pin: GND

## Library data of the parts
C1-2-C1-4 C1-8-C1-26 C5-1-C5-8 C9-1 = Capacitor1
C2-1 C2-2 = Capacitor1205
C3-1 C3-2 C3-2B C3-3 C3-4 C4-1-C4-14 = Cap 0805: Capacitor
  C3-1 C3-2 C3-2B C3-3 C3-4 C4-6 C4-13: Digikey P/N: 587-3485-1-ND
  C4-1-C4-5 C4-7-C4-12 C4-14: Digikey P/N: 490-14439-1-ND
C6-1 C6-2 = Cap: Capacitor; Digikey P/N: 587-3714-1-ND
C7-1 C7-2 C8-1 C8-2 = Cap: Capacitor; FP: 0603 (1608 Metric)
  C7-1 C7-2: Digikey P/N: 490-14466-1-ND
  C8-1 C8-2: Digikey P/N: 1276-1009-1-ND
CE-1 CE-1B = CapElectrolytic2: ElectrolyticCap; Digikey P/N: PCE5120CT-ND
DL-1 = DLatch: D-Latch; FP: 6-TSSOP; Digikey P/N: 296-16998-1-ND
I1-1 = Inductor3: Inductor; Digikey P/N: 732-11747-1-ND
Jack1 = PowerJack3: Digikey P/N: CP-051AH-ND, 1470-3143-ND
LA0 = LEDSINGLESIDE: Note on Resistors: Two kinds depending on V drop of LED.; Digikey P/N: 160-2211-2-ND
PS1 = PowerSupplySwitching: Digikey P/N: 945-2647-5-ND
PWM1 PWM2 = PWM28: PWM; Digikey P/N: 568-11925-1-ND
R1-1 R1-2 R1-5-R1-29 R3-3-R3-5 R4-3-R4-5 R4-5B R5-1-R5-9 = Res1
R1-30-R1-33 R1-35-R1-39 R9-1 R9-2 = Res1: Resistor; FP: 0603 (1608 Metric)
  R1-30-R1-33 R1-35-R1-39: Digikey P/N: 311-10.0KHRCT-ND
  R9-1 R9-2: Digikey P/N: 13-RT0603FRE07270KLCT-ND
R2-1 R6-1 R6-1B R6-2 R6-2B R6-3-R6-14 R7-1-R7-8 = Res1: Resistor
  R2-1: Digikey P/N: 541-4611-1-ND
  R6-1 R6-1B R6-2 R6-2B R6-3-R6-14 R7-1-R7-8: Digikey P/N: 2019-RK73B1JTTD201JCT-ND; Footprint: 0603 (1608 Metric)
Ref1 = 2V5Ref: Digikey P/N: 505-ADR4533BRZ-R7CT-ND
TVS-1 TVS-2 TVS-3V3-1-TVS-3V3-4 = TVS_Diode16
  TVS-1 TVS-2: Digikey P/N: 1655-S16LC05-8CT-ND
  TVS-3V3-1-TVS-3V3-4: Digikey P/N: 1655-S16LC03-8CT-ND
VReg1 = 5V Reg LowNoise: 5V Regulator Low Noise; Digikey P/N: ADM7150ARDZ-5.0-R7CT-ND
VReg2 = 5V Reg LowNoise: 3V3 Regulator Low Noise; Digikey P/N: 505-ADM7150ARDZ-3.3-R7CT-ND
VReg3 VReg5_2 = 4V Regulator: FP: SOT-23-5; DS: http://www.ti.com/lit/ds/symlink/lp2985-n.pdf
  VReg3: Digikey P/N: 296-18476-1-ND
  VReg5_2: Digikey P/N: 296-20717-1-ND
WD1 = Watchdog: FP: SOT-23-5; Digikey: https://www.digikey.co.uk/product-detail/en/stmicroelectronics/STWD100NYWY3F/497-10058-1-ND/2175107; Digikey P/N: 497-10058-1-ND
ADC = ADS7828: Digikey P/N: 296-24101-1-ND
ADC1-ADC8 DAC1-DAC8 GPIO13 GPIO25-GPIO32 IN(5V)-1-IN(5V)-4 OUT(5V)-1-OUT(5V)-4 = SMA_Female: Digikey P/N: 2057-RF2-04A-T-00-50-G-ND
Camera1 = KinetixCameraConnector: Digikey P/N: HR1251-ND
Cnt1-Cnt3 = Counter_$017: Digikey P/N: 296-14252-1-ND
DAC-1 = AD5668-2: Digikey P/N: 505-AD5668BRUZ-1-ND
DIR_13=OUT DIR_25=OUT DIR_26=OUT DIR_27=OUT DIR_28=OUT DIR_31=OUT DIR_32=OUT LED1-8-LED1-14 NOT_OK OK = LEDindicator: Digikey: https://www.digikey.co.uk/product-detail/en/osram-opto-semiconductors-inc/LG-R971-KN-1/475-1410-1-ND/1802598; Digikey P/N: 475-1410-1-ND
F0 = FerriteBead1: Digikey P/N: 4816-BPH853025R5-101TCT-ND
F1-F8 = FerriteBead2: Digikey P/N: 445-MPZ1608S600ATAH0CT-ND
H1-H4 = Header_RA_2x10: Digikey P/N: SAM8104-ND, SAM8089-ND
J1-1 J1-12-J1-23 = Jumper3: Digikey P/M: 609-3461-ND, S9000-ND
J1-2-J1-5 J1-5B J1-6 J1-6B J1-7 J1-7B J1-8 J1-8B J1-9 J1-9B J1-10 J1-11 J1-24 JHB = Jumper3B: Digikey P/M: 609-3461-ND, S9000-ND
J6 = Jumper2_Pins: Digikey P/M: 609-3461-ND, S9000-ND
LA1-LA9 LB0-LB9 LC0-LC9 = LEDSINGLESIDE: Digikey P/N: 160-2211-2-ND
LvL-1-LvL-3 = LevelShift_8: Digikey P/N: 296-SN74LXCH8T245PWRCT-ND
LVL_GPIO13 LVL_GPIO25-LVL_GPIO28 LVL_GPIO31 LVL_GPIO32 ShiftLED1 ShiftLED2 = LevelShift_1: Digikey P/N: 296-SN74LXCH1T45DCKRCT-ND
MCU1 = Teensy4p1: Digikey P/N: 1568-DEV-20360-ND
N1 N2 = NOT: Digikey P/N: 296-11607-1-ND
S1-S4 = Switch_4: Digikey P/N: 497-19518-1-ND
T1-T3 = TEstPoint: Digikey P/N: 36-5014-ND
Terminal1 = Header_16x2: Digikey P/N: 277-13904-ND
Timer1 = TImer_555: Digikey P/N: 296-6501-1-ND